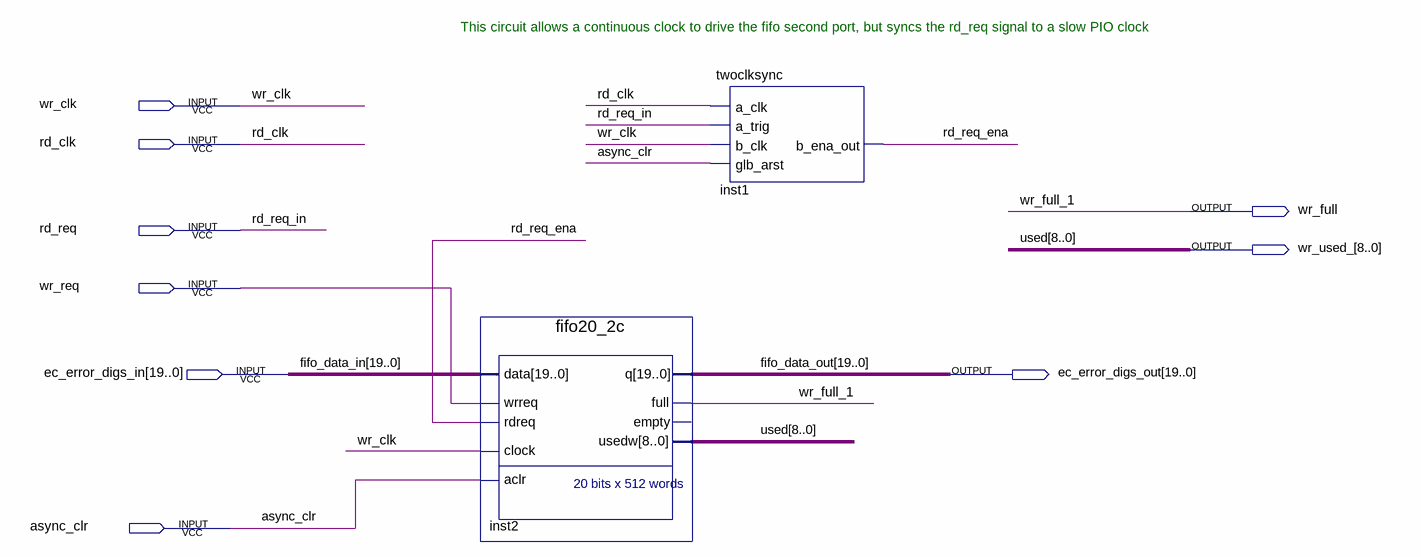
[diagram p0: schematic sheet]
// Quartus schematic fifo_ec_correct_digits.bdf as structural Verilog: 2 symbols, 9 pins
module fifo_ec_correct_digits (
  input  wr_clk,
  input  rd_clk,
  input  rd_req,
  input  wr_req,
  input  [19:0] ec_error_digs_in,
  input  async_clr,
  output wr_full,
  output [8:0] wr_used_,
  output [19:0] ec_error_digs_out
);

  wire rd_req_ena;

  fifo20_2c inst2 (
    .data(ec_error_digs_in), .wrreq(wr_req), .rdreq(rd_req_ena), .clock(wr_clk), .aclr(async_clr),
    .q(ec_error_digs_out), .full(wr_full), .usedw(wr_used_));  // open: empty
  twoclksync inst1 (.a_clk(rd_clk), .b_clk(wr_clk), .glb_arst(async_clr), .a_trig(rd_req), .b_ena_out(rd_req_ena));

  // Other names for the same wires on the sheet: fifo_data_in[19:0] = ec_error_digs_in;
  //   fifo_data_out[19:0] = ec_error_digs_out; rd_req_in = rd_req; used[8:0] = wr_used_; wr_full_1 = wr_full

  // Notes on the sheet:
  //   This circuit allows a continuous clock to drive the fifo second port, but syncs the rd_req signal to a slow PIO clock
endmodule
